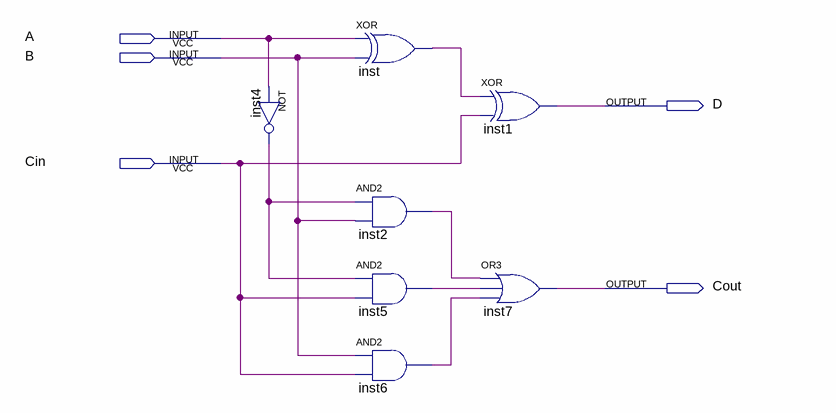
[diagram p0: schematic sheet]
// Quartus schematic Decr_1bit.bdf as structural Verilog: 7 symbols, 5 pins
module Decr_1bit (
  input  A,
  input  B,
  input  Cin,
  output D,
  output Cout
);

  wire inst2_out, inst4_out, inst5_out, inst6_out, inst_out;

  not inst4 (inst4_out, A);
  xor inst (inst_out, A, B);
  and inst2 (inst2_out, inst4_out, B);
  and inst5 (inst5_out, inst4_out, Cin);
  and inst6 (inst6_out, B, Cin);
  xor inst1 (D, inst_out, Cin);
  or inst7 (Cout, inst2_out, inst5_out, inst6_out);
endmodule
